# EAGLE schematic T05_version11_8b (EAGLE 7.1.0)
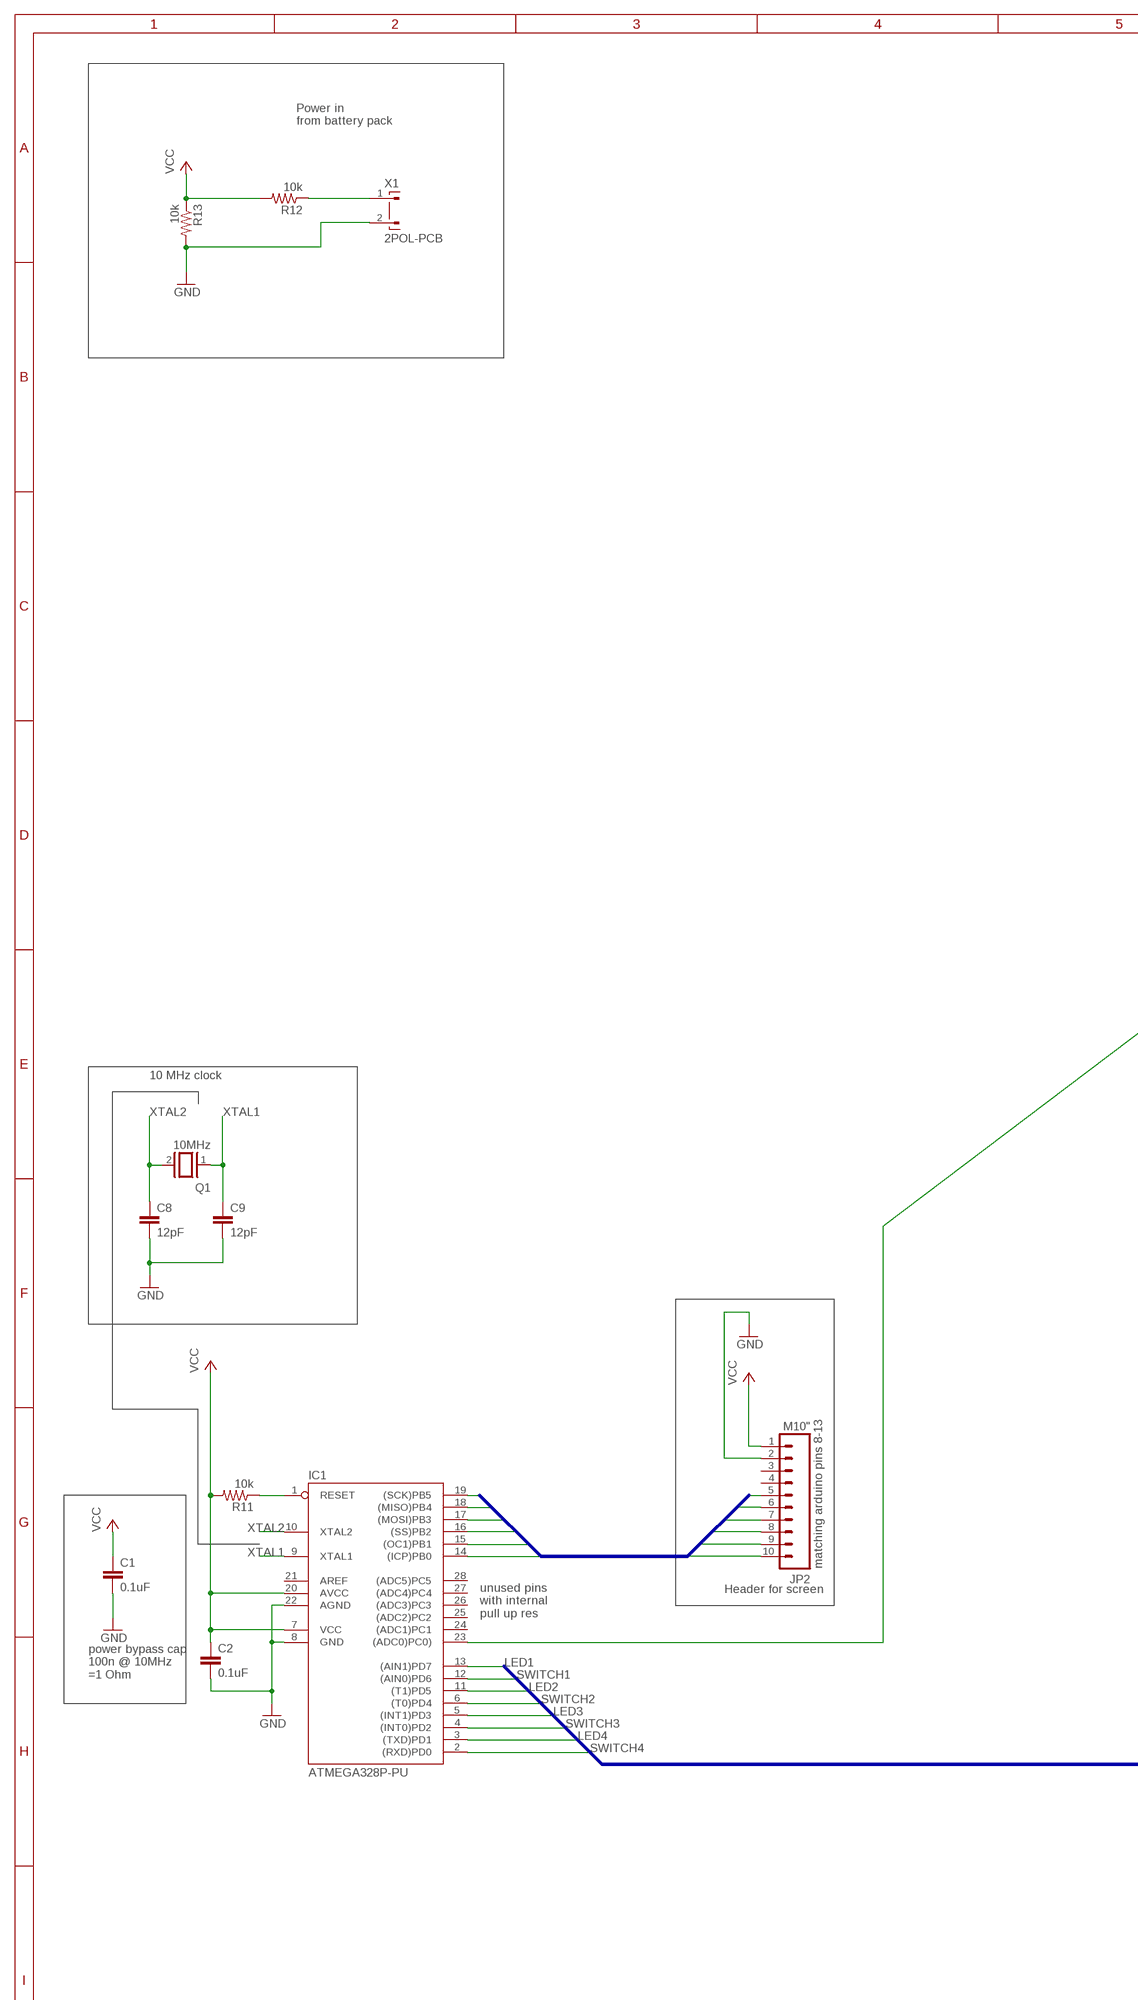
[diagram p0: schematic, sheet 1, part 1 of 2]
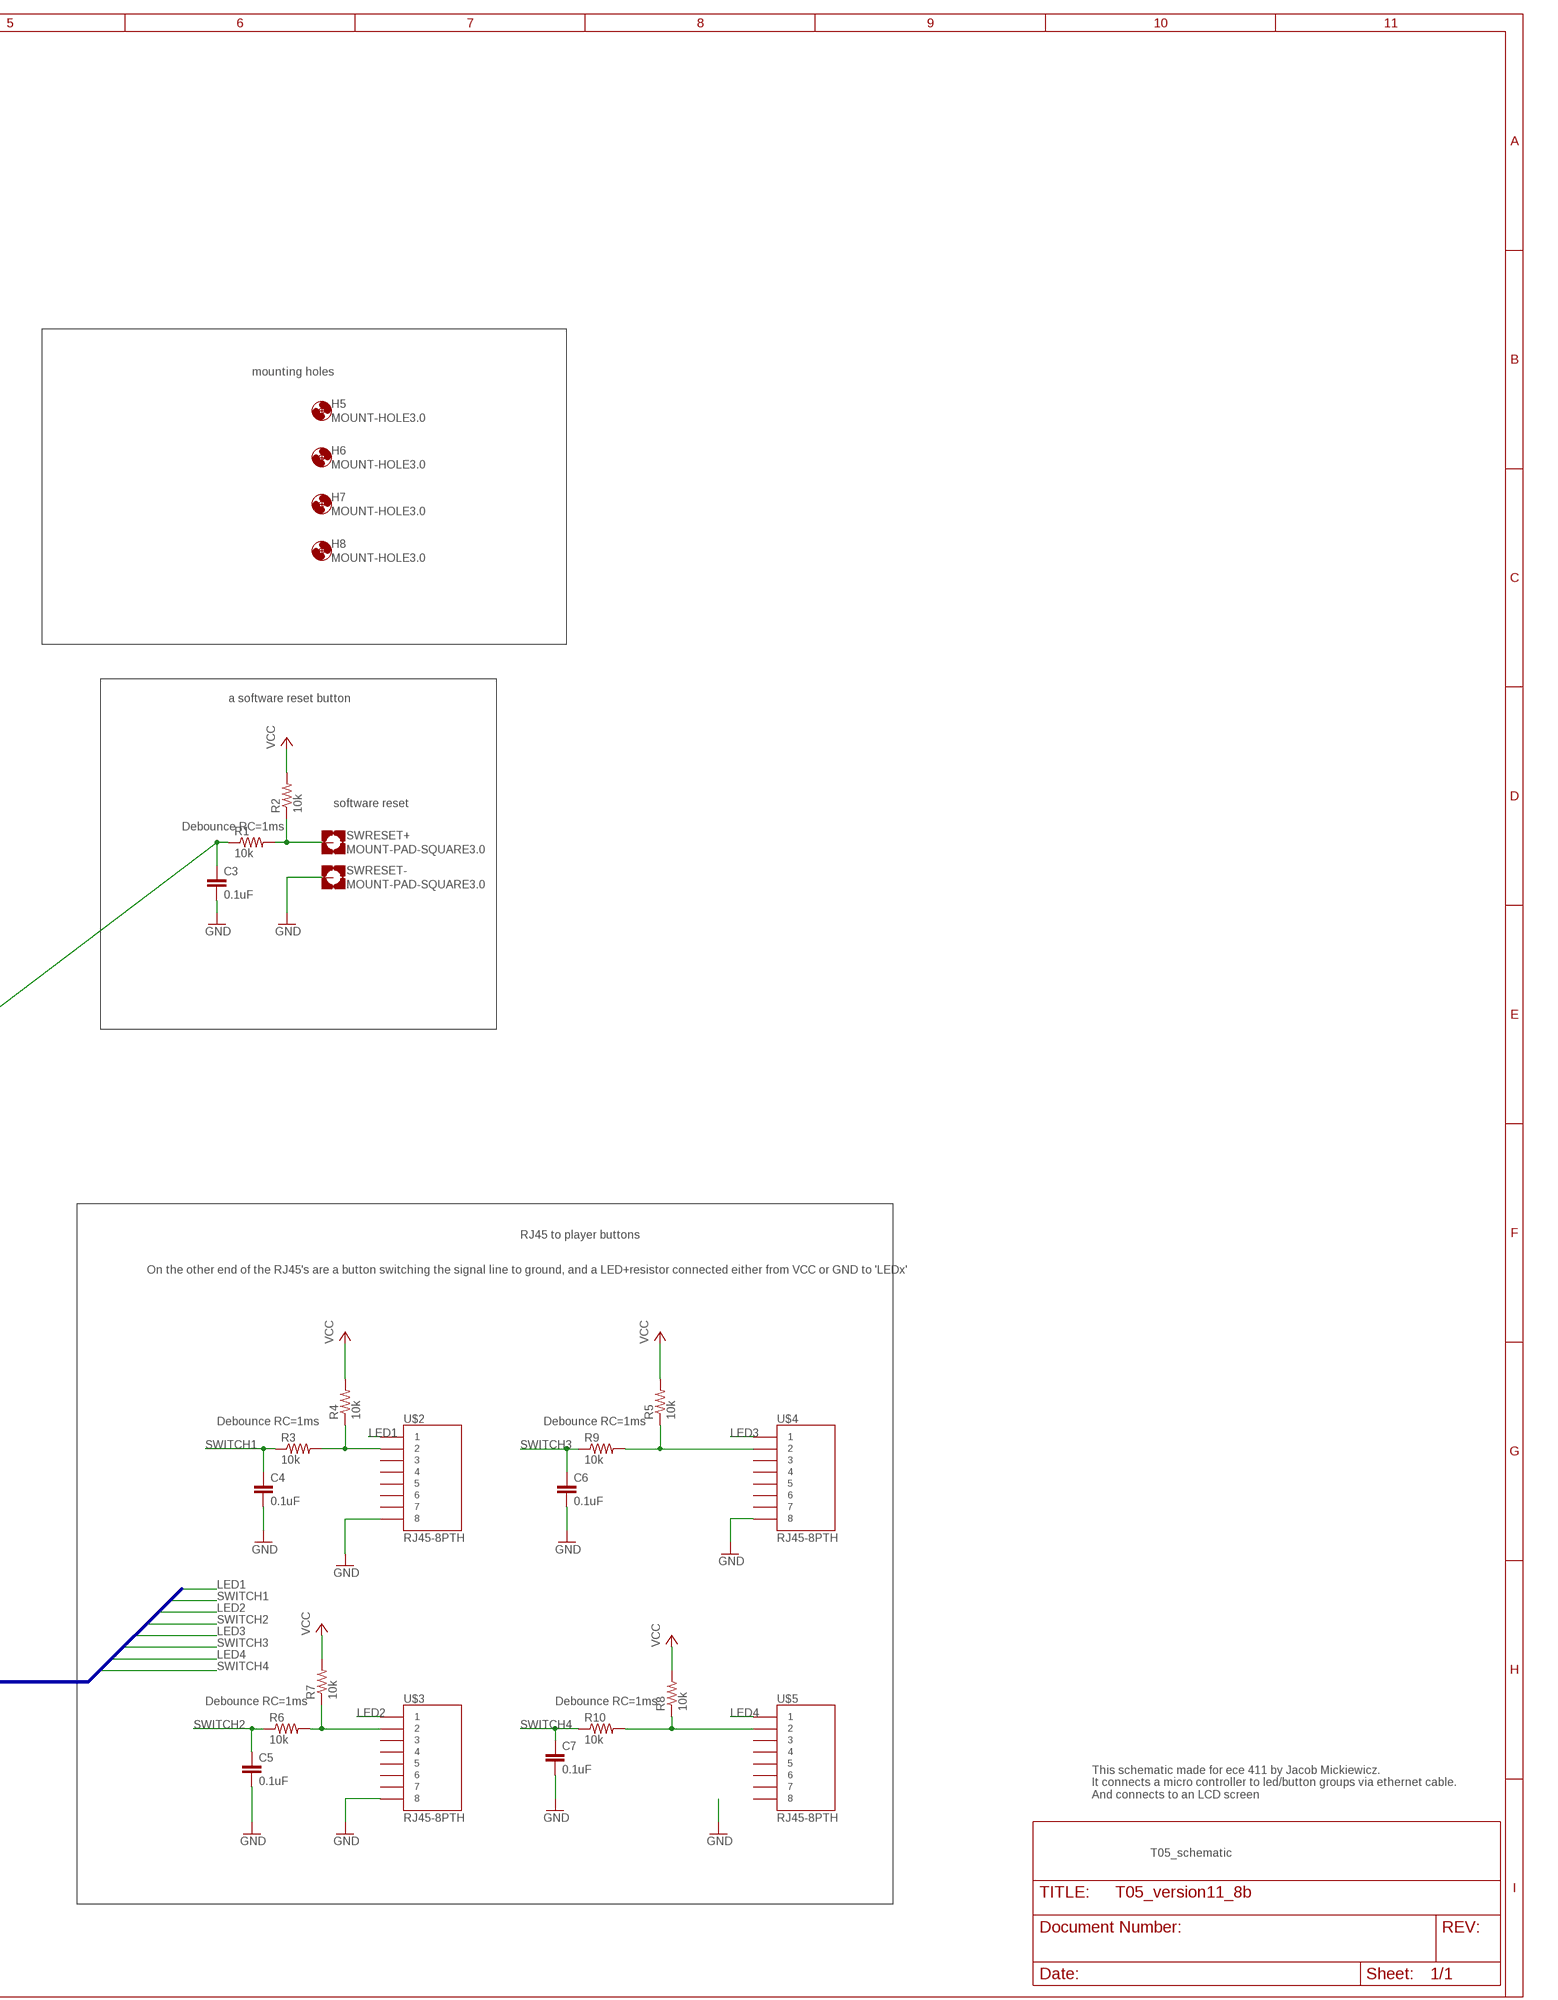
[diagram p1: schematic, sheet 1, part 2 of 2]

## Parts
C1  0.1uF  0.1UF-25V-5%(0603)  [0603-CAP]
C2  0.1uF  0.1UF-25V-5%(0603)  [0603-CAP]
C3  0.1uF  0.1UF-25V-5%(0603)  [0603-CAP]
C4  0.1uF  0.1UF-25V-5%(0603)  [0603-CAP]
C5  0.1uF  0.1UF-25V-5%(0603)  [0603-CAP]
C6  0.1uF  0.1UF-25V-5%(0603)  [0603-CAP]
C7  0.1uF  0.1UF-25V-5%(0603)  [0603-CAP]
C8  12pF  10NF/10000PF-50V-10%(0603)  [0603-CAP]
C9  12pF  10NF/10000PF-50V-10%(0603)  [0603-CAP]
H5  MOUNT-HOLE3.0  [3,0]
H6  MOUNT-HOLE3.0  [3,0]
H7  MOUNT-HOLE3.0  [3,0]
H8  MOUNT-HOLE3.0  [3,0]
IC1  ATMEGA328P-PU  [DIL28-3]
JP2  M10"  [1X10]
Q1  10MHz  XTAL/S  [QS]
R1  10k  RESISTOR0603-RES  [0603-RES]
R2  10k  RESISTOR0603-RES  [0603-RES]
R3  10k  RESISTOR0603-RES  [0603-RES]
R4  10k  RESISTOR0603-RES  [0603-RES]
R5  10k  RESISTOR0603-RES  [0603-RES]
R6  10k  RESISTOR0603-RES  [0603-RES]
R7  10k  RESISTOR0603-RES  [0603-RES]
R8  10k  RESISTOR0603-RES  [0603-RES]
R9  10k  RESISTOR0603-RES  [0603-RES]
R10  10k  RESISTOR0603-RES  [0603-RES]
R11  10k  RESISTOR0603-RES  [0603-RES]
R12  10k  RESISTOR0603-RES  [0603-RES]
R13  10k  RESISTOR0603-RES  [0603-RES]
SWRESET+  MOUNT-PAD-SQUARE3.0  [3,0-PAD-SQUARE]
SWRESET-  MOUNT-PAD-SQUARE3.0  [3,0-PAD-SQUARE]
U$2  RJ45-8PTH  [RJ45-8]
U$3  RJ45-8PTH  [RJ45-8]
U$4  RJ45-8PTH  [RJ45-8]
U$5  RJ45-8PTH  [RJ45-8]
X1  2POL-PCB  [2POL-PCB]

## Nets
GND [gnd]: C1.2 C2.2 C3.2 C4.2 C5.2 C6.2 C7.2 C8.2 C9.2 IC1.8(GND) IC1.22(AGND) JP2.2 R13.2 SWRESET-.B3,0(MOUNT) U$2.8 U$3.8 U$4.8 X1.2
ICP: IC1.14((ICP)PB0) JP2.10
LED1: IC1.13((AIN1)PD7) U$2.1
LED2: IC1.11((T1)PD5) U$3.1
LED3: IC1.5((INT1)PD3) U$4.1
LED4: IC1.3((TXD)PD1) U$5.1
MISO: IC1.18((MISO)PB4) JP2.6
MOSI: IC1.17((MOSI)PB3) JP2.7
N$3: IC1.1(RESET) R11.1
N$8: R3.2 R4.1 U$2.2
N$9: R8.1 R10.2 U$5.2
N$10: R1.2 R2.1 SWRESET+.B3,0(MOUNT)
N$12: R6.2 R7.1 U$3.2
N$13: R5.1 R9.2 U$4.2
N$16: R12.1 X1.1
OC1: IC1.15((OC1)PB1) JP2.9
SCK: IC1.19((SCK)PB5) JP2.5
SS: IC1.16((SS)PB2) JP2.8
SW_RESET: C3.1 IC1.23((ADC0)PC0)) R1.1
SWITCH1: C4.1 IC1.12((AIN0)PD6) R3.1
SWITCH2: C5.1 IC1.6((T0)PD4) R6.1
SWITCH3: C6.1 IC1.4((INT0)PD2) R9.1
SWITCH4: C7.1 IC1.2((RXD)PD0) R10.1
VCC [vcc]: C1.1 C2.1 IC1.7(VCC) IC1.20(AVCC) JP2.1 R2.2 R4.2 R5.2 R7.2 R8.2 R11.2 R12.2 R13.1
XTAL1: C9.1 IC1.9(XTAL1) Q1.1
XTAL2: C8.1 IC1.10(XTAL2) Q1.2
Unconnected: IC1.21(AREF) IC1.24((ADC1)PC1) IC1.25((ADC2)PC2) IC1.26((ADC3)PC3) IC1.27((ADC4)PC4) IC1.28((ADC5)PC5) JP2.3 JP2.4 U$2.3 U$2.4 U$2.5 U$2.6 U$2.7 U$3.3 U$3.4 U$3.5 U$3.6 U$3.7 U$4.3 U$4.4 U$4.5 U$4.6 U$4.7 U$5.3 U$5.4 U$5.5 U$5.6 U$5.7 U$5.8

## Buses
PLAYER_BUTTONS:LED[1..4],SWITCH[1..4]
PORT_B:SCK,MISO,MOSI,SS,OC1,ICP

## Notes on the sheet
- Power in
  from battery pack
- mounting holes
- a software reset button
- software reset
- Debounce RC=1ms
- 10 MHz clock
- RJ45 to player buttons
- On the other end of the RJ45's are a button switching the signal line to ground, and a LED+resistor connected either from VCC or GND to 'LEDx'
- Debounce RC=1ms | Debounce RC=1ms
- matching arduino pins 8-13
- Header for screen
- unused pins
  with internal 
  pull up res
- power bypass cap
  100n @ 10MHz
  =1 Ohm
- Debounce RC=1ms | Debounce RC=1ms
- This schematic made for ece 411 by Jacob Mickiewicz.
  It connects a micro controller to led/button groups via ethernet cable.
  And connects to an LCD screen
- T05_schematic

## Library data of the parts
C1-C7 = SparkFun-Capacitors:0.1UF-25V-5%(0603): CAP-08604; PROD_ID: CAP-08604
C8 C9 = SparkFun-Capacitors:10NF/10000PF-50V-10%(0603): CAP-00867; PROD_ID: CAP-00867; VALUE: 10nF
H5-H8 = holes:MOUNT-HOLE: MOUNTING HOLE with drill center marker
IC1 = SmartPrj:ATMEGA328P-: MICROCONTROLLER 4 Kbytes FLASH 128 bytes SRAM 256 bytes EEPROM UART 6-channel 10 bit ADC
JP2 = SparkFun-Connectors:M10: Header 10 Standard 10-pin 0.1" header. Use with straight break away headers (SKU : PRT-00116), right angle break away headers (PRT-00553), swiss pins (PRT-00743), machine pins (PRT-00117), and female headers (PRT-00115).
Q1 = special:XTAL/S: CRYSTAL
R1-R13 = SparkFun-Passives:RESISTOR: Resistor Basic schematic elements and footprints for 0603, 1206, and PTH resistors.
SWRESET+ SWRESET- = holes:MOUNT-PAD-SQUARE: MOUNTING PAD, square
U$2-U$5 = SparkFun-Connectors:RJ45-8: RJ45 Jack Simple RJ45, 8-pin connection - connector for common Cat5, Cat5e, and Cat6 Ethernet cables. Footprint not yet proven in production. Connector sku is PRT-00643; Breakout PCB sku is BOB-00716.
X1 = con-friwo:2POL-PCB: PCB SUPPLY CONNECTOR FRIWO (TEXAS); OC_FARNELL: unknown; OC_NEWARK: unknown

## Net classes
0 default: width 0.254 mm, clearance 0.254 mm
1 vcc: width 1.27 mm, clearance 0.254 mm to class 0, clearance 0.254 mm
2 gnd: width 0.254 mm, clearance 0.508 mm to class 0, clearance 0.254 mm to class 1, clearance 0.254 mm